# Altium schematic sheet Case2.SchDoc
size A4
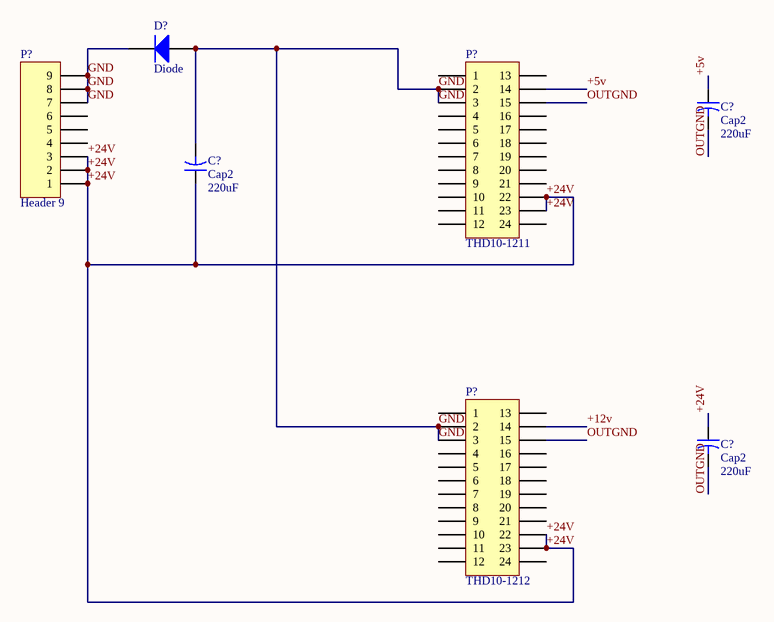
[diagram p0: Case2.SchDoc]

## Parts
(Parts that share a designator on the sheet are numbered #1, #2 ... from top to bottom, then left to right.)
C?#1  Cap2  value 220uF  [CAPR5-4X5]
C?#2  Cap2  value 220uF  [CAPR5-4X5]
C?#3  Cap2  value 220uF  [CAPR5-4X5]
D?  Diode  [SMC]
P?#1  THD10-1211  [HDR2X12_CEN]
P?#2  Header 9  [HDR1X9]
P?#3  THD10-1212  [HDR2X12_CEN]

## Nets
+5v: C?#1.1 P?#1.14
+12v: P?#3.14
+24V: C?#2.1 C?#3.1 P?#1.22 P?#1.23 P?#2.1 P?#2.2 P?#2.3 P?#3.22 P?#3.23
GND: C?#2.2 D?.1(A) D?.2(K) P?#1.2 P?#1.3 P?#2.7 P?#2.8 P?#2.9 P?#3.2 P?#3.3
OUTGND: C?#1.2 C?#3.2 P?#1.15 P?#3.15

Not connected (* = marked no-connect by the designer): P?#1 1 4 5 6 7 8 9 10 11 12 13 16 17 18 19 20 21 24; P?#2 4 5 6; P?#3 1 4 5 6 7 8 9 10 11 12 13 16 17 18 19 20 21 24

## Library data of the parts
C?#1-C?#3 = Cap2: Capacitor; Published: 23-Sep-2002; PackageReference: CAPR5-4X5; Publisher: Altium Limited
D? = Diode: Default Diode; Published: 8-Jun-2000; LatestRevisionDate: 17-Jul-2002; LatestRevisionNote: Re-released for DXP Platform.; PackageDocument: Sep-1996; PackageReference: SMC; Publisher: Altium Limited; Code_JEDEC: DO-214-AB
P?#1 P?#3 = Header 12X2A: Header, 12-Pin, Dual row; LatestRevisionDate: 17-Jul-2002; LatestRevisionNote: Re-released for DXP Platform.; Publisher: Altium Limited
P?#2 = Header 9: Header, 9-Pin; LatestRevisionDate: 17-Jul-2002; LatestRevisionNote: Re-released for DXP Platform.; Publisher: Altium Limited